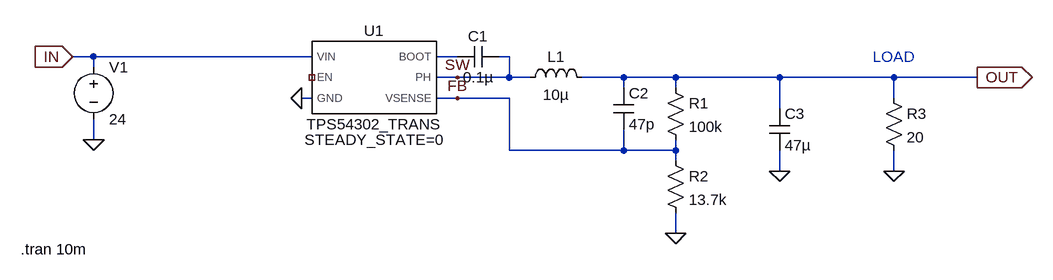
[diagram p0: schematic 5V.asc]
5V.asc, the LTspice schematic file:
Version 4
SHEET 1 1292 680
WIRE -176 128 -208 128
WIRE 160 128 -176 128
WIRE 384 128 352 128
WIRE 464 128 448 128
WIRE -176 144 -176 128
WIRE 384 160 352 160
WIRE 464 160 464 128
WIRE 464 160 384 160
WIRE 496 160 464 160
WIRE 640 160 576 160
WIRE 720 160 640 160
WIRE 880 160 720 160
WIRE 1056 160 880 160
WIRE 1184 160 1056 160
WIRE 640 176 640 160
WIRE 720 176 720 160
WIRE 160 192 144 192
WIRE 384 192 352 192
WIRE 464 192 384 192
WIRE 1056 192 1056 160
WIRE 880 208 880 160
WIRE -176 256 -176 224
WIRE 464 272 464 192
WIRE 640 272 640 240
WIRE 640 272 464 272
WIRE 720 272 720 256
WIRE 720 272 640 272
WIRE 720 288 720 272
WIRE 880 304 880 272
WIRE 1056 304 1056 272
WIRE 720 400 720 368
FLAG 720 400 0
FLAG 384 160 SW
FLAG 384 192 FB
FLAG 1184 160 OUT
IOPIN 1184 160 Out
FLAG -208 128 IN
IOPIN -208 128 In
FLAG -176 256 0
FLAG 144 192 0
FLAG 1056 304 0
FLAG 880 304 0
SYMBOL TPS54302_TRANS 256 160 R0
SYMATTR InstName U1
SYMBOL cap 448 112 R90
WINDOW 0 0 32 VBottom 2
WINDOW 3 32 32 VTop 2
SYMATTR InstName C1
SYMATTR Value 0.1µ
SYMBOL ind 480 176 R270
WINDOW 0 32 56 VTop 2
WINDOW 3 5 56 VBottom 2
SYMATTR InstName L1
SYMATTR Value 10µ
SYMATTR SpiceLine Ipk=5.5 Rser=0.068
SYMBOL cap 624 176 R0
SYMATTR InstName C2
SYMATTR Value 47p
SYMBOL res 704 160 R0
SYMATTR InstName R1
SYMATTR Value 100k
SYMBOL res 704 272 R0
SYMATTR InstName R2
SYMATTR Value 13.7k
SYMBOL voltage -176 128 R0
WINDOW 123 0 0 Left 0
WINDOW 39 0 0 Left 0
SYMATTR InstName V1
SYMATTR Value 24
SYMBOL res 1040 176 R0
SYMATTR InstName R3
SYMATTR Value 20
SYMBOL cap 864 208 R0
SYMATTR InstName C3
SYMATTR Value 47µ
SYMATTR SpiceLine Rser=1m
TEXT -288 424 Left 2 !.tran 10m
TEXT 1056 144 Bottom 2 ;LOAD

The netlist it stands for:
* 5V.asc
XU1 N001 NC_01 0 SW IN FB TPS54302_TRANS STEADY_STATE=0  ; pins BOOT EN GND PH VIN VSENSE
C1 SW N001 0.1µ
L1 SW OUT 10µ Ipk=5.5 Rser=0.068
C2 OUT FB 47p
R1 OUT FB 100k
R2 FB 0 13.7k
V1 IN 0 24
R3 OUT 0 20
C3 OUT 0 47µ Rser=1m
.tran 10m
* LOAD
.lib C:\Users\Tachi\Documents\Nerd Shit\rm_electrical-supercap\SPICE_sims\libraries\TPS54302_TRANS.LIB
.backanno
.end